# Altium schematic sheet Arduino_side.SchDoc
size A4; Organization: Altium Limited; Address1: L3, 12a Rodborough Rd; Address2: Frenchs Forest; Address3: NSW; Address4: Australia 2086; SheetNumber: 1; SheetTotal: 3
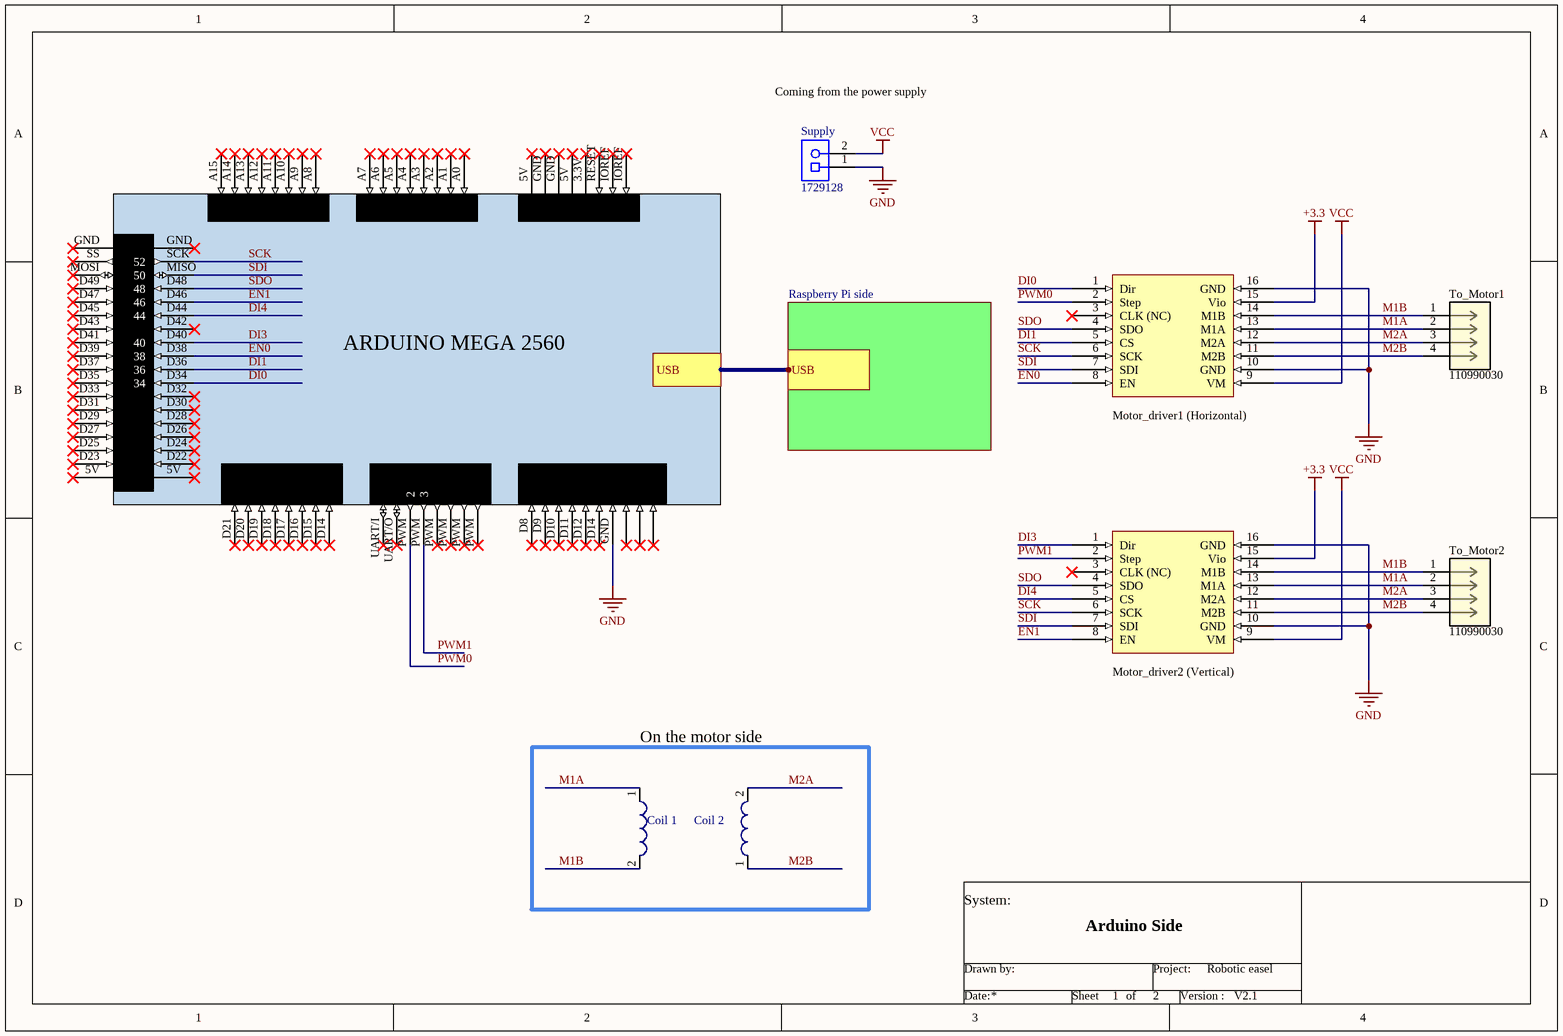
[diagram p0: Arduino_side.SchDoc]

## Parts
(Parts that share a designator on the sheet are numbered #1, #2 ... from top to bottom, then left to right.)
*?#1  Arduino MEGA 2560  (value not drawn)  (part C of 8)
*?#2  Arduino MEGA 2560  (value not drawn)  (part B of 8)
*?#3  Arduino MEGA 2560  (value not drawn)  (part A of 8)
*?#4  Arduino MEGA 2560  (value not drawn)  (part D of 8)
*?#5  Arduino MEGA 2560  (value not drawn)  (part E of 8)
*?#6  Arduino MEGA 2560  (value not drawn)  (part F of 8)
*?#7  Arduino MEGA 2560  (value not drawn)  (part G of 8)
L?#1  Coil 1  [3830]
L?#2  Coil 2  [3830]
Motor_driver1_(Horizontal)  driver  [DIP16]  (value not drawn)
Motor_driver2_(Vertical)  driver  [DIP16]  (value not drawn)
Supply  1729128  [PHOE-1729128-2_V]
To_Motor1  110990030  [CONN_110990030_SEE]
To_Motor2  110990030  [CONN_110990030_SEE]

## Blocks framed on the sheet
ARDUINO MEGA 2560: *?#4-*?#7
On the motor side: L?#1 L?#2

## Sub-sheets
Raspberry Pi side = Raspi_side.SchDoc: USB

## Ports
USB

## Nets
+3.3: Motor_driver1_(Horizontal).15(Vio) Motor_driver2_(Vertical).15(Vio)
GND: *?#7.GND Motor_driver1_(Horizontal).10(GND) Motor_driver1_(Horizontal).16(GND) Motor_driver2_(Vertical).10(GND) Motor_driver2_(Vertical).16(GND) Supply.1
VCC: Motor_driver1_(Horizontal).9(VM) Motor_driver2_(Vertical).9(VM) Supply.2
DI0: *?#4.D34(34) Motor_driver1_(Horizontal).1(Dir)
DI1: *?#4.D36(36) Motor_driver1_(Horizontal).5(CS)
DI3: *?#4.D40(40) Motor_driver2_(Vertical).1(Dir)
DI4: *?#4.D44(44) Motor_driver2_(Vertical).5(CS)
EN0: *?#4.D38(38) Motor_driver1_(Horizontal).8(EN)
EN1: *?#4.D46(46) Motor_driver2_(Vertical).8(EN)
M1A: L?#1.1 Motor_driver1_(Horizontal).13(M1A) Motor_driver2_(Vertical).13(M1A) To_Motor1.2 To_Motor2.2
M1B: L?#1.2 Motor_driver1_(Horizontal).14(M1B) Motor_driver2_(Vertical).14(M1B) To_Motor1.1 To_Motor2.1
M2A: L?#2.2 Motor_driver1_(Horizontal).12(M2A) Motor_driver2_(Vertical).12(M2A) To_Motor1.3 To_Motor2.3
M2B: L?#2.1 Motor_driver1_(Horizontal).11(M2B) Motor_driver2_(Vertical).11(M2B) To_Motor1.4 To_Motor2.4
PWM0: *?#6.PWM(2) Motor_driver1_(Horizontal).2(Step)
PWM1: *?#6.PWM(3) Motor_driver2_(Vertical).2(Step)
SCK: *?#4.SCK(52) Motor_driver1_(Horizontal).6(SCK) Motor_driver2_(Vertical).6(SCK)
SDI: *?#4.MISO(50) Motor_driver1_(Horizontal).7(SDI) Motor_driver2_(Vertical).7(SDI)
SDO: *?#4.D48(48) Motor_driver1_(Horizontal).4(SDO) Motor_driver2_(Vertical).4(SDO)
USB: port USB, sheet Raspberry Pi side/USB

Not connected (* = marked no-connect by the designer): *?#1 A8* A9* A10* A11* A12* A13* A14* A15*; *?#2 A0* A1* A2* A3* A4* A5* A6* A7*; *?#3 3.3V* 5V* GND* IOREF* RESET*; *?#4 5V* D22* D23* D24* D25* D26* D27* D28* D29* D30* D31* D32* D33* D35* D37* D39* D41* D42(42)* D43* D45* D47* D49* GND* MOSI* SS*; *?#5 D14* D15* D16* D17* D18* D19* D20* D21*; *?#6 UART/I* UART/O*; *?#7 ?1* ?2* ?3* D8* D9* D10* D11* D12* D14*; Motor_driver1_(Horizontal) 3(CLK_(NC))*; Motor_driver2_(Vertical) 3(CLK_(NC))*

## Notes on the sheet
- Coming from the power supply
- Arduino Side
- Robotic easel
- 1
- 2
- V2.1
- System:
- Drawn by:
- Project:
- Date:
- Sheet
- of
- Version :

## Library data of the parts
L?#1 L?#2 = CMP-1432-00002-1: Wireless Power Charging Coil  WE-WPCC, L=16.7 µH; Manufacturer: Wuerth Elektronik; PartNumber: 760308103204; Inductance: 16.7 ÂµH; ComponentLink2Description: Datasheet; ComponentLink1Description: Manufacturer URL; PackageReference: 3830; ComponentLink1URL: http://www.we-online.com; ComponentLink2URL: http://katalog.we-online.de/kataloge/eisos/media/pdf/760308103204.pdf
Motor_driver1_(Horizontal) Motor_driver2_(Vertical) = TMC2130: Motor driver with spi communication
Supply = CMP-2000-05815-1: PCB Terminal Block, 13.5 A, 400 V, 2-Pin THD, RoHS, Bulk; Manufacturer: Phoenix Contact; Package Version: 03/2015; No. of Rows: 1; Pitch: 5.08mm; No. of Positions: 2; Voltage Rating: 400V; Current Rating: 13500mA; Manufacturer URL: http://www.phoenixcontact.com/; Datasheet URL: https://datasheet.ciiva.com/16046/1729128-16046181.pdf; RoHS: TRUE; Package URL: https://www.phoenixcontact.com/online/portal/pi/pxc/product_detail_page/!ut/p/b1/3VdJjqNKFDxLH8AFycySyWY2ozFsEPOMMQaDOX1XedGL_1Vdm5YXJleknhSKeBkvI6EA8ncAo3AYoDhBQGco6KN7VURTdemj9us_IEKEZo_YHiPAEWEFmDGOHMORkqKYCORBZxgL7ZoaZYcbFFUZ3fqxSY6GOuxydWUuHqz1ynmMFygu583Bob0Ewr6Sd_l-5m-kAueHiB0jpRwZwe58wwtkpxtMYd_LmGcDRU02dRNEyWt6Y2ti5pSyJ_reIkzIulrqApdnbT11V5jnCKbYNCvhEM1MCpPByat_X379-iThf08CI5GfOPqfBeS3BRoBOdD55AKVv0iLwCMq-2BrzXWSGRH7pUGD9uwXQjiph3xL0DKQwdGa0JImiIOmBNOestqgwTHSSs2oOep-78apyXQBvNi8ZLaFjvjWvcaUEBu0MC6Wbe-d6mB0FAebo2lUWinqYaZs5DAYzV0RP9yitUjnGJ0iI9xhZkT42OCQNUJJhkgWINNQLP2JFP6OpMg3JCVg70jqHT0lvKOnhHf0lPuOnnLf0VPuWx6_dxwUIvwk5WMkT0kLL1mh61l2yZVSzG3pYV_bqo-mj6uMKwKwdnnW8Jh5RTOJzMOA5c-eJDaZQw4mTMPH02PvS_ZAqNVjVTo2WyYLkwH_KU1mmmG5kjRhDqPXLwwVHvVOjCM60-fpXvTDfMGW1PVFVS1r4e4yVDk4ZdNbkUHvqPqQSeian4UD39fNKmachqdJ1NJbyk8rXT9mXTvPk3oE5meulKGgiruPJek-4I9hTT6G8ZLOyRSm2RRVbThERQad5OS28hdt4YW4vG0stgYYzsWsK4_7y6DZMjJSCqri1kyiZR5vD7pwIrNR7QwPHTcLTI5qT7eRlpHrdGiupYlqQDJ7zy_CND8fWWBoLRXxk1RVcXiBQwbTD4Xi7KL-FuO94t9xaqweXzH; PartNumber: 1729128; Package Description: 2-Pin Through Hole Device, Body 8.1 x 10.16 mm, Pitch 5.08 mm; Datasheet Version: 12/2013; Mounting Technology: ThroughHole; Orientation: Horizontal; Package Reference: 1729128-2; Packing: Bulk
To_Motor1 To_Motor2 = 110990030: No Description Available; Mfr_Name: Seeed Studio; Copyright: Copyright (C) 2022 Ultra Librarian. All rights reserved.; Manufacturer_Part_Number: 110990030; RefDes: RefDes; Type: DEV